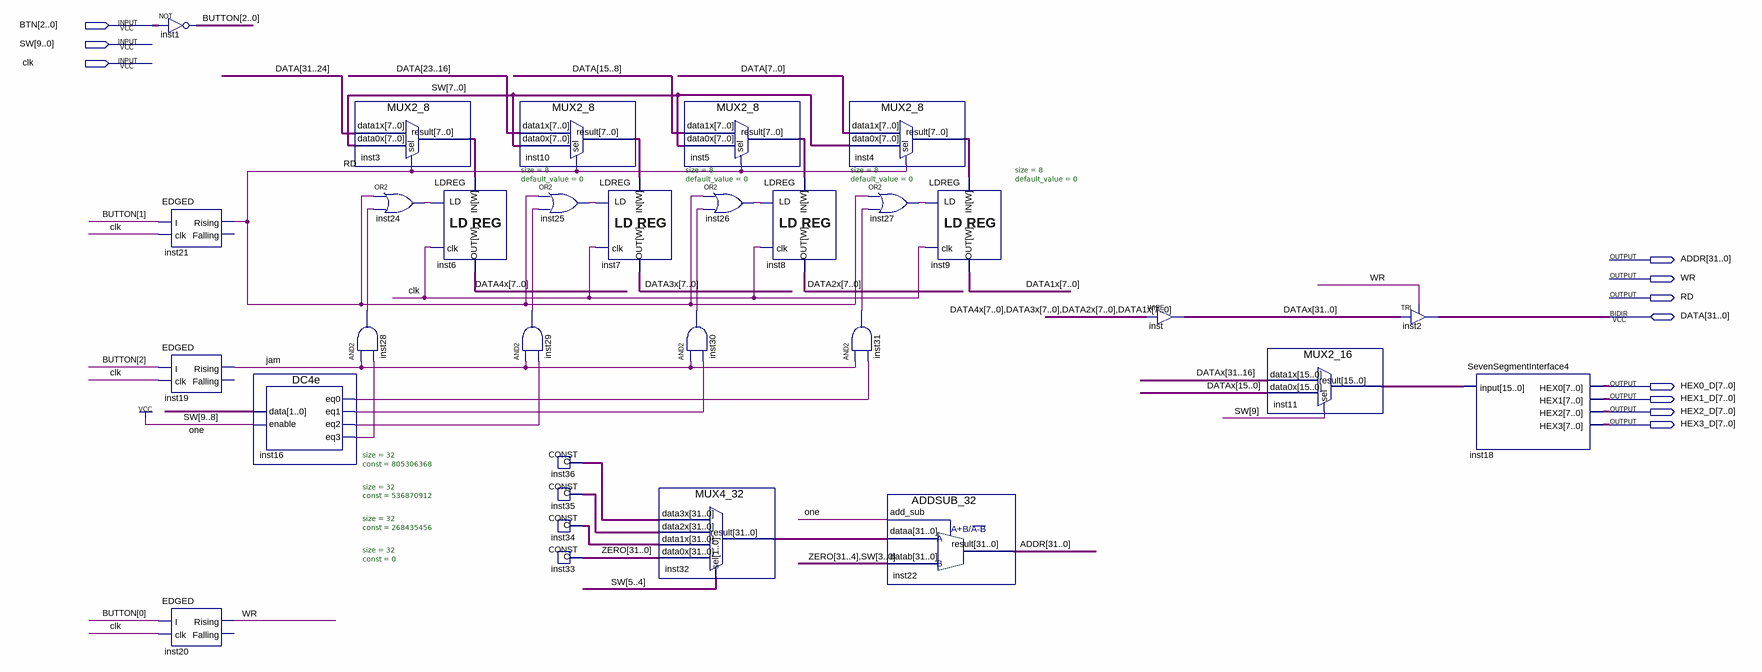
[diagram p0: schematic sheet]
// Quartus schematic LaManualMagistrala.bdf as structural Verilog: 31 symbols, 11 pins
module LaManualMagistrala (
  input  [2:0] BTN,
  input  [9:0] SW,
  input  clk,
  inout  [31:0] DATA,
  output [31:0] ADDR,
  output WR,
  output RD,
  output [7:0] HEX0_D,
  output [7:0] HEX1_D,
  output [7:0] HEX2_D,
  output [7:0] HEX3_D
);

  wire inst16_eq0, inst16_eq1, inst16_eq2, inst16_eq3, inst24_out, inst25_out, inst26_out, inst27_out,
       inst28_out, inst29_out, inst30_out, inst31_out, jam;
  wire [2:0] BUTTON;
  wire [7:0] DATA1x, DATA2x, DATA3x, DATA4x, inst3_result, inst4_result, inst5_result, inst10_result;
  wire [15:0] inst11_result;
  wire [31:0] DATAx, inst32_result, inst34_data, inst35_data, inst36_data, ZERO;

  assign BUTTON = ~BTN;  // NOT inst1, 3 bits wide
  EDGED inst21 (.I(BUTTON[1]), .clk(clk), .Rising(RD));  // open: Falling
  EDGED inst19 (.I(BUTTON[2]), .clk(clk), .Rising(jam));  // open: Falling
  EDGED inst20 (.I(BUTTON[0]), .clk(clk), .Rising(WR));  // open: Falling
  DC4e inst16 (.data(SW[9:8]), .enable(1'b1), .eq0(inst16_eq0), .eq1(inst16_eq1), .eq2(inst16_eq2), .eq3(inst16_eq3));
  MUX2_8 inst3 (.data1x(DATA[31:24]), .data0x(SW[7:0]), .sel(RD), .result(inst3_result));
  or inst24 (inst24_out, RD, inst28_out);
  and inst28 (inst28_out, jam, inst16_eq3);
  LDREG #(.size(8), .default_value(0)) inst6 (.clk(clk), .data_in(inst3_result), .ld(inst24_out), .data_out(DATA4x));
  MUX2_8 inst10 (.data1x(DATA[23:16]), .data0x(SW[7:0]), .sel(RD), .result(inst10_result));
  and inst29 (inst29_out, jam, inst16_eq2);
  or inst25 (inst25_out, RD, inst29_out);
  CONST #(.size(32), .\const (805306368)) inst36 (.data(inst36_data));
  CONST #(.size(32), .\const (536870912)) inst35 (.data(inst35_data));
  CONST #(.size(32), .\const (268435456)) inst34 (.data(inst34_data));
  CONST #(.size(32), .\const (0)) inst33 (.data(ZERO));
  LDREG #(.size(8), .default_value(0)) inst7 (.clk(clk), .data_in(inst10_result), .ld(inst25_out), .data_out(DATA3x));
  and inst30 (inst30_out, jam, inst16_eq1);
  MUX4_32 inst32 (
    .data3x(inst36_data), .data2x(inst35_data), .data1x(inst34_data), .data0x(ZERO), .sel(SW[5:4]),
    .result(inst32_result));
  MUX2_8 inst5 (.data1x(DATA[15:8]), .data0x(SW[7:0]), .sel(RD), .result(inst5_result));
  or inst26 (inst26_out, RD, inst30_out);
  LDREG #(.size(8), .default_value(0)) inst8 (.clk(clk), .data_in(inst5_result), .ld(inst26_out), .data_out(DATA2x));
  MUX2_8 inst4 (.data1x(DATA[7:0]), .data0x(SW[7:0]), .sel(RD), .result(inst4_result));
  or inst27 (inst27_out, RD, inst31_out);
  and inst31 (inst31_out, jam, inst16_eq0);
  LDREG #(.size(8), .default_value(0)) inst9 (.clk(clk), .data_in(inst4_result), .ld(inst27_out), .data_out(DATA1x));
  ADDSUB_32 inst22 (.add_sub(1'b1), .dataa(inst32_result), .datab({ZERO[31:4], SW[3:0]}), .result(ADDR));
  assign DATAx = {DATA4x, DATA3x, DATA2x, DATA1x};  // WIRE inst
  MUX2_16 inst11 (.data1x(DATAx[31:16]), .data0x(DATAx[15:0]), .sel(SW[9]), .result(inst11_result));
  TRI inst2[31:0] (.IN(DATAx), .OE(WR), .OUT(DATA));
  SevenSegmentInterface4 inst18 (.\input (inst11_result), .HEX0(HEX0_D), .HEX1(HEX1_D), .HEX2(HEX2_D), .HEX3(HEX3_D));
endmodule
